# EasyEDA Pro project ADXL.epro

# Schematic USB ADXL Schematic
Board Name: Board1_1; Create Date: 2026-04-03; Page Name: P1; Project Name: Cuprite 3D Printer; Schematic Name: USB ADXL Schematic; Update Date: 2026-04-02; Company: EasyEDA.com; Page Size: A4; Version: V1.0
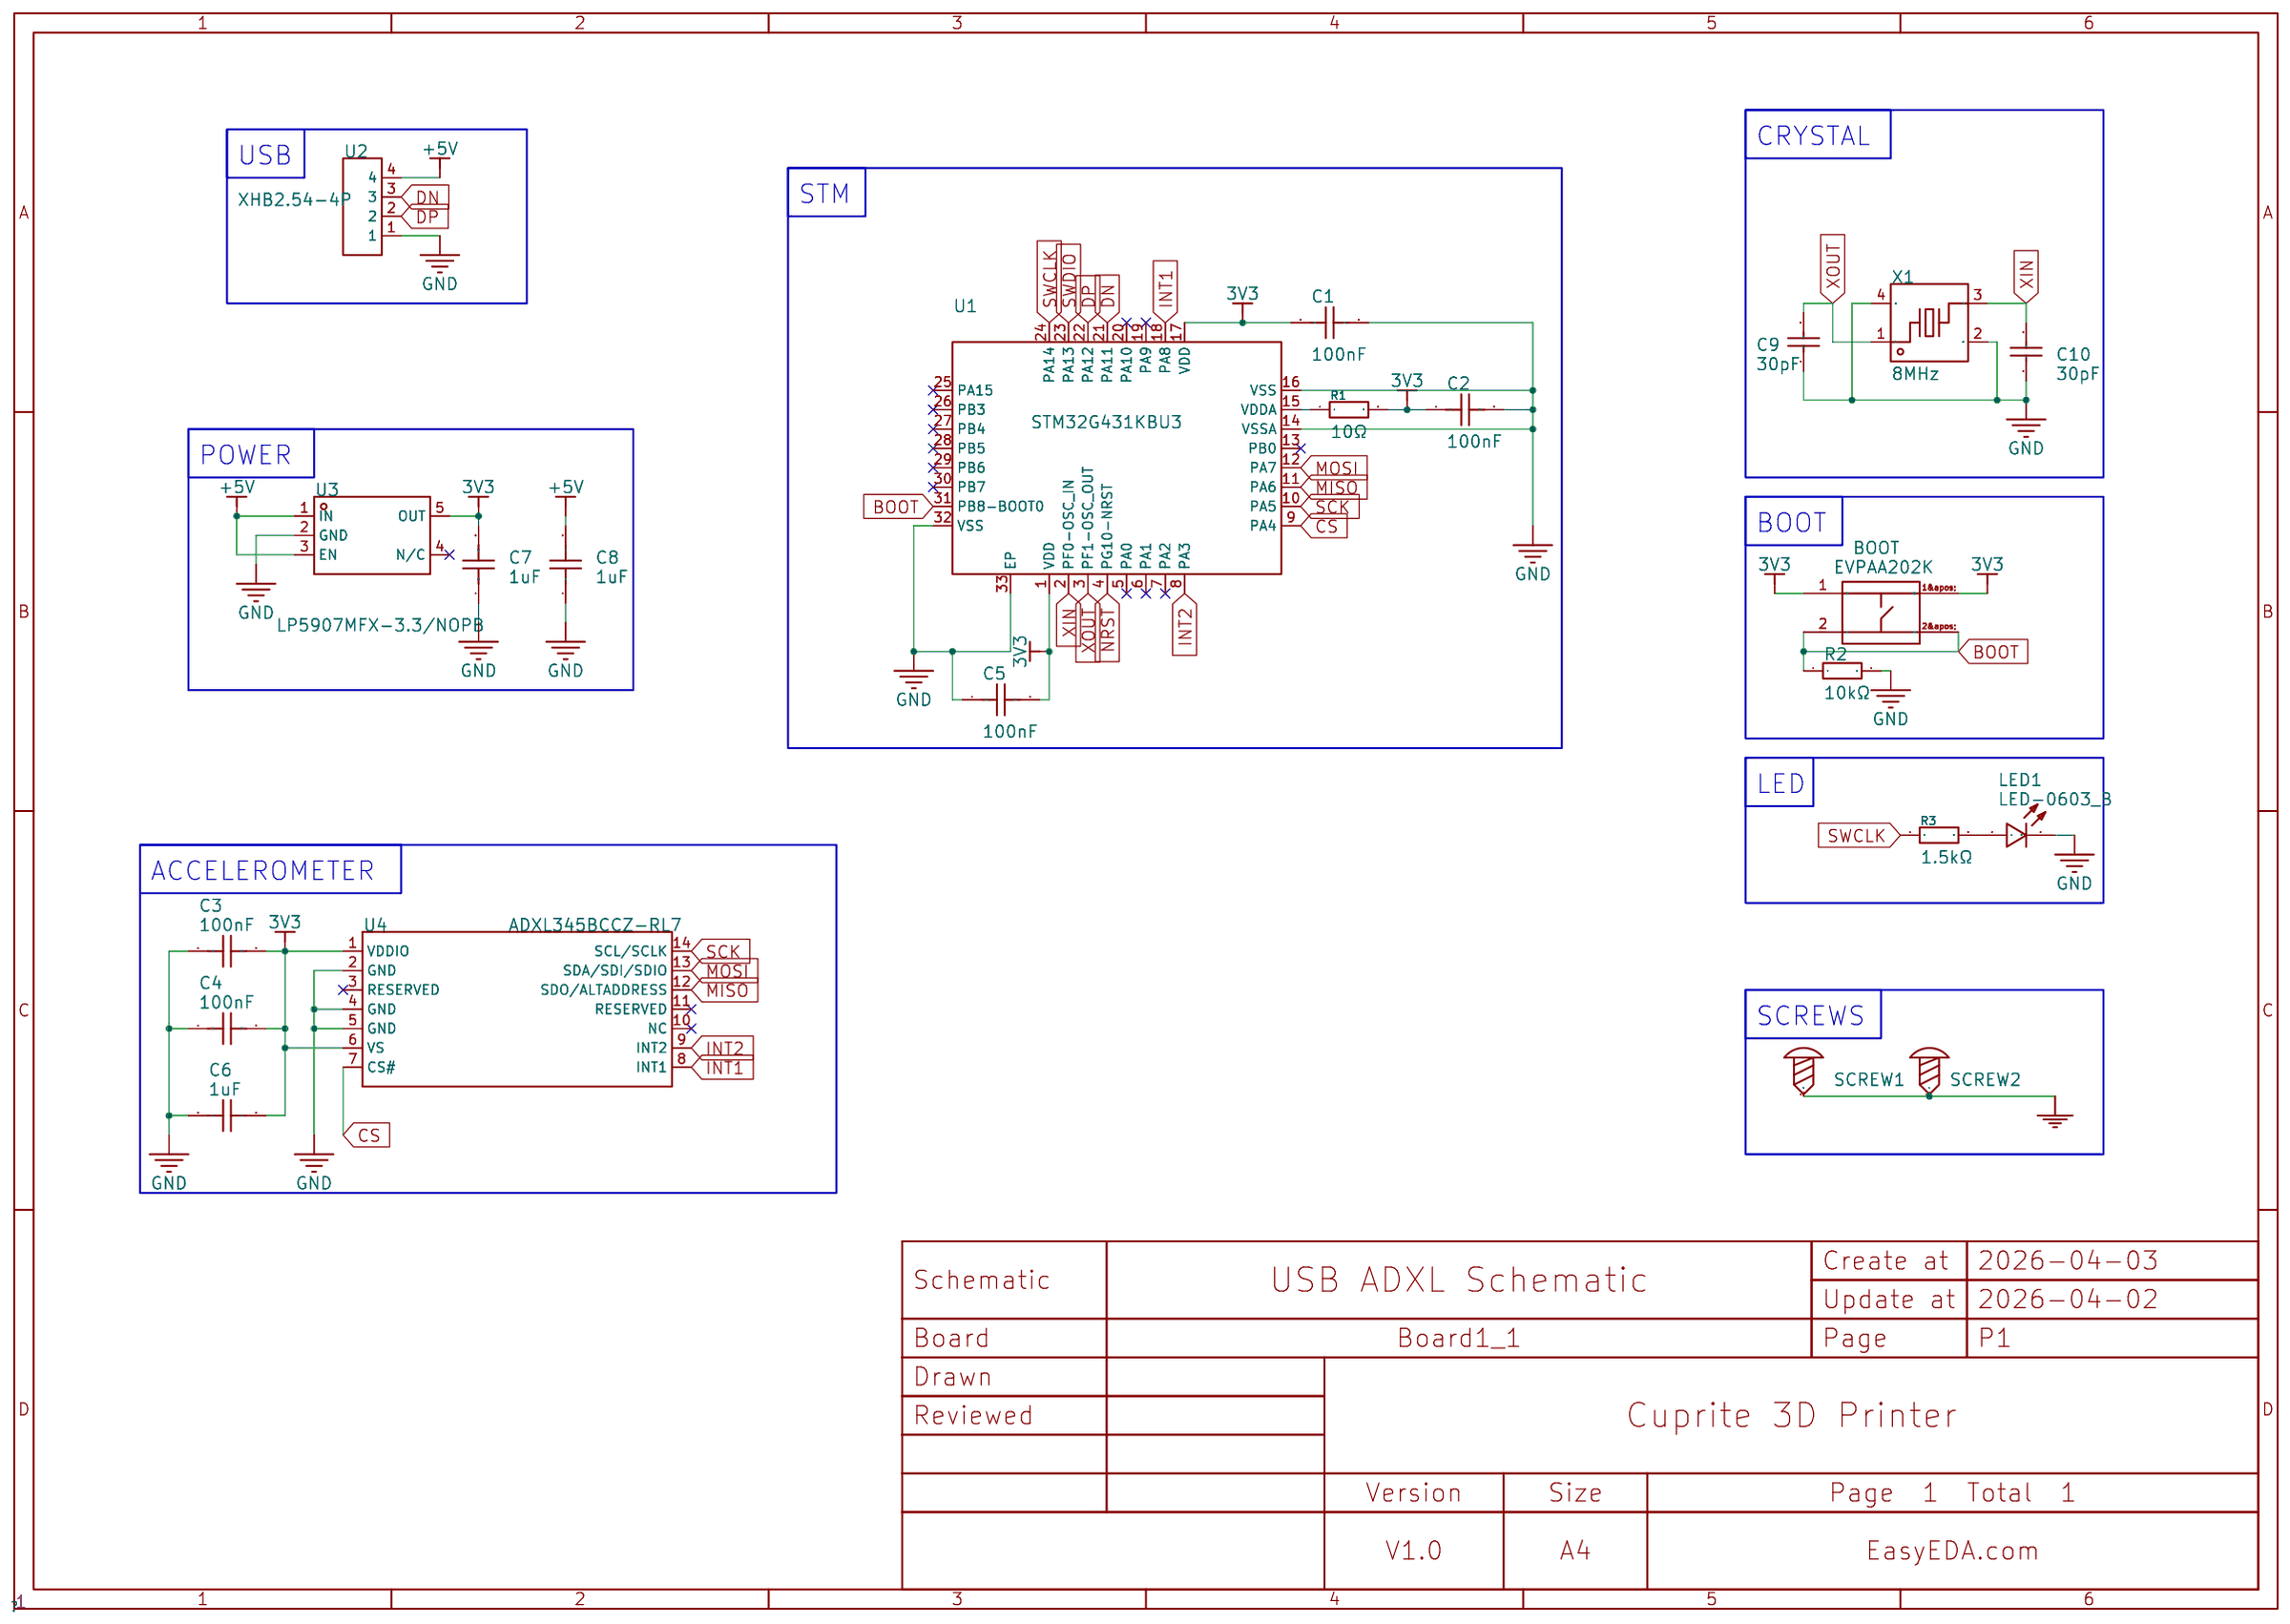
[diagram p0: schematic sheet]

## Parts
BOOT  EVPAA202K  [KEY-SMD_4P-L3.5-W2.9-P1.48-LS4.3-TL]
C1  100nF  [C0402]
C2  100nF  [C0402]
C3  100nF  [C0402]
C4  100nF  [C0402]
C5  100nF  [C0402]
C6  1uF  [C0402]
C7  1uF  [C0402]
C8  1uF  [C0402]
C9  30pF  [C0402]
C10  30pF  [C0402]
LED1  LED-0603_B  [LED0603-FD_BLUE]
R1  10Ω  [R0402]
R2  10kΩ  [R0402]
R3  1.5kΩ  [R0402]
SCREW1  -  [Screw-Hole-M3]
SCREW2  -  [Screw-Hole-M3]
U1  STM32G431KBU3  [UFQFPN-32_L5.0-W5.0-P0.50-BL-EP3.5]
U2  XHB2.54-4P  [CONN-TH_4P-P2.54-XH2.54-LI-4P]
U3  LP5907MFX-3.3/NOPB  [SOT-23-5_L3.0-W1.7-P0.95-LS2.8-BR]
U4  ADXL345BCCZ-RL7  [LGA-14_L5.0-W3.0-P0.80-BL]
X1  8MHz  [CRYSTAL-SMD_4P-L3.2-W2.5-BL-2]

## Library data of the parts
BOOT = EVPAA202K: Circuit:SPST Actuator Style:Rectangle button Operating Force:1.6N Mounting Style:Brick nogging Switch Length:3.5mm Switch Width:2.9mm Switch Height:1.7mm Contact Current:20mA Voltage Rating (AC):- Voltage Rating (DC):15V Insulation Resistance:100MΩ With L; LCSC Part Name: 3.5*2.9*1.7mm 立贴 轻触开关; Supplier Part: C79147; Manufacturer: PANASONIC(松下); Supplier Footprint: SMD,2.9x3.5mm; JLCPCB Part Class: Extended Part; Datasheet: https://atta.szlcsc.com/upload/public/pdf/source/20160718/1468827513915.pdf; Supplier: LCSC; Circuit: SPST; Actuator Style: Rectangle button; Operating Force: 1.6N; Mounting Style: Brick nogging; Switch Length: 3.5mm; Switch Width: 2.9mm; Switch Height: 1.7mm; Contact Current: 20mA; Voltage Rating (DC): 15V; Insulation Resistance: 100MΩ; Pin Style: J pin; Mechanical Life: 20万次; Operating Temperature: -40℃~+85℃
C1-C5 = CL05B104KO5NNNC: Capacitance: Tolerance:±10% Tolerance:±10% Voltage Rated: Temperature Coefficient:; LCSC Part Name: 100nF ±10% 16V; Supplier Part: C1525; Manufacturer: SAMSUNG(三星); Supplier Footprint: 0402; JLCPCB Part Class: Basic Part; Datasheet: https://atta.szlcsc.com/upload/public/pdf/source/20160218/1457707763339.pdf; Supplier: LCSC; Tolerance: ±10%
C6-C8 = CL05A105KA5NQNC: Capacitance: Tolerance:±10% Tolerance:±10% Voltage Rated: Temperature Coefficient:; LCSC Part Name: 1uF ±10% 25V; Supplier Part: C52923; Manufacturer: SAMSUNG(三星); Supplier Footprint: 0402; JLCPCB Part Class: Basic Part; Datasheet: https://atta.szlcsc.com/upload/public/pdf/source/20160218/1457707763339.pdf; Supplier: LCSC; Tolerance: ±10%
C9 C10 = 0402CG300J500NT: Capacitance:30pF Tolerance:±5% Tolerance:±5% Voltage Rating:50V Temperature Coefficient:C0G; LCSC Part Name: 30pF ±5% 50V; Supplier Part: C1570; Manufacturer: FH(风华); Supplier Footprint: 0402; JLCPCB Part Class: Extended Part; Datasheet: https://atta.szlcsc.com/upload/public/pdf/source/20200305/C486355_26A10D38EF8C2A5C37091D0039909270.pdf; Supplier: LCSC; Tolerance: ±5%; Voltage Rating: 50V; Temperature Coefficient: C0G
LED1 = 19-217/BHC-ZL1M2RY/3T: Emitted Color:Blue Power Dissipation:110mW Forward Current:5mA Dominant Wavelength:465nm~475nm Dominant Wavelength:465nm~475nm Peak Wavelength:468nm Diode Configuration:- Lens Color:Colorless Transparent Lens Color Temperature:- Color Temperature:- Viewin; LCSC Part Name: 蓝灯 停产; Supplier Part: C72041; Manufacturer: EVERLIGHT(亿光); Supplier Footprint: 0603; Datasheet: https://atta.szlcsc.com/upload/public/pdf/source/20170116/1484561237273.pdf; Supplier: LCSC; Emitted Color: Blue; Power Dissipation: 110mW; Forward Current: 5mA; Dominant Wavelength: 465nm~475nm; Peak Wavelength: 468nm; Lens Color: Colorless Transparent Lens; Viewing Angle: 120°; Operating Temperature: -40℃~+85℃
R1 = 0402WGF100JTCE: Type:Thick Film Resistors Resistance:10Ω Tolerance:±1% Tolerance:±1% Power(Watts): Overload Voltage (Max): Temperature Coefficient:±200ppm/℃ Temperature Coefficient:±200ppm/℃ Operating Temperature Range:-55℃~+155℃ Operating Temperature Range:-55℃~+155℃; LCSC Part Name: 10Ω ±1% 62.5mW 厚膜电阻; Supplier Part: C25077; Manufacturer: UNI-ROYAL(厚声); Supplier Footprint: 0402; JLCPCB Part Class: Basic Part; Datasheet: https://atta.szlcsc.com/upload/public/pdf/source/20200306/C422600_1E6D84923E4A46A82E41ADD87F860B5C.pdf; Supplier: LCSC; Type: Thick Film Resistors; Tolerance: ±1%; Temperature Coefficient: ±200ppm/℃; Operating Temperature Range: -55℃~+155℃
R2 = 0402WGF1002TCE: Type:Thick Film Resistors Resistance:10kΩ Tolerance:±1% Tolerance:±1% Power(Watts): Overload Voltage (Max): Temperature Coefficient:±100ppm/℃ Temperature Coefficient:±100ppm/℃ Operating Temperature Range:-55℃~+155℃ Operating Temperature Range:-55℃~+155℃; LCSC Part Name: 10kΩ ±1% 62.5mW 厚膜电阻; Supplier Part: C25744; Manufacturer: UNI-ROYAL(厚声); Supplier Footprint: 0402; JLCPCB Part Class: Basic Part; Datasheet: https://atta.szlcsc.com/upload/public/pdf/source/20200306/C422600_1E6D84923E4A46A82E41ADD87F860B5C.pdf; Supplier: LCSC; Type: Thick Film Resistors; Tolerance: ±1%; Temperature Coefficient: ±100ppm/℃; Operating Temperature Range: -55℃~+155℃
R3 = 0402WGF1501TCE: Type:Thick Film Resistors Resistance:1.5kΩ Tolerance:±1% Tolerance:±1% Power(Watts): Overload Voltage (Max): Temperature Coefficient:±100ppm/℃ Temperature Coefficient:±100ppm/℃ Operating Temperature Range:-55℃~+155℃ Operating Temperature Range:-55℃~+155℃; LCSC Part Name: 1.5kΩ ±1% 62.5mW 厚膜电阻; Supplier Part: C25867; Manufacturer: UNI-ROYAL(厚声); Supplier Footprint: 0402; JLCPCB Part Class: Basic Part; Datasheet: https://atta.szlcsc.com/upload/public/pdf/source/20200306/C422600_1E6D84923E4A46A82E41ADD87F860B5C.pdf; Supplier: LCSC; Type: Thick Film Resistors; Tolerance: ±1%; Temperature Coefficient: ±100ppm/℃; Operating Temperature Range: -55℃~+155℃
SCREW1 SCREW2 = Screw-Hole-M3: Supplier Footprint: 插件
U1 = STM32G431KBU3: CPU Core:ARM-M4 CPU Maximum Speed:170MHz Program Storage Size:128KB Program Memory Type:FLASH Number of I/O:26 ADC (Bit):12bit DAC (Bit):12bit Voltage - Supply:1.71V~3.6V Voltage - Supply:1.71V~3.6V Applications:-; LCSC Part Name: 带DSP和FPU的170MHz主流ARM Cortex-M4 MCU，具有128 KB Flash存储器、数学加速器和中等模拟电平集成; Supplier Part: C1341901; Manufacturer: ST(意法半导体); Supplier Footprint: UFQFPN-32(5x5); JLCPCB Part Class: Extended Part; Datasheet: https://atta.szlcsc.com/upload/public/pdf/source/20210607/F3CD0646E5D00AAFDE875C196C2D7333.pdf; Supplier: LCSC; CPU Core: ARM-M4; CPU Maximum Speed: 170MHz; Program Storage Size: 128KB; Program Memory Type: FLASH; Number of I/O: 26; ADC (Bit): 12bit; DAC (Bit): 12bit; Voltage - Supply: 1.71V~3.6V
U2 = XHB2.54-4P: Supplier Part: C9900014704; JLCPCB Part Class: Extended Part; Supplier: LCSC
U3 = LP5907MFX-3.3/NOPB: Output Type:Fixed Maximum Input Voltage:5.5V Output Voltage:3.3V Output Voltage:3.3V Output Current:250mA Power Supply Rejection Ratio (PSRR):90dB@(100Hz)；60dB@(100kHz) Dropout Voltage:250mV@(250mA) standby current:25uA Feature:ESD Protection；Short-Circui; LCSC Part Name: 具有低 IQ 和使能功能的 250mA、低噪声、高 PSRR、超低压降稳压器; Supplier Part: C80670; Manufacturer: TI(德州仪器); Supplier Footprint: SOT-23-5; JLCPCB Part Class: Extended Part; Datasheet: https://www.ti.com/cn/lit/gpn/lp5907; Supplier: LCSC; Output Type: Fixed; Maximum Input Voltage: 5.5V; Output Voltage: 3.3V; Output Current: 250mA; Power Supply Rejection Ratio (PSRR): 90dB@(100Hz)；60dB@(100kHz); Dropout Voltage: 250mV@(250mA); standby current: 25uA; Feature: ESD Protection；Short-Circuit  Protection；Automatic Discharge Function；Low ESR；Thermal Protection(TSD)；Under-voltage Lockout；With ability; Operating Temperature: -40℃~+125℃; Output Polarity: Positive electrode; Number of Outputs: 1
U4 = ADXL345BCCZ-RL7: LCSC Part Name: 3轴、±2 G/±4 G/±8 G/±16 G数字加速度计; Supplier Part: C9667; Manufacturer: ADI(亚德诺); Supplier Footprint: LGA-14(3x5); Datasheet: https://atta.szlcsc.com/upload/public/pdf/source/20170717/C9667_1500286943358822273.pdf; Supplier: LCSC
X1 = 3TJ480000ZYLBC: Crystal Type:贴片晶振 Frequency: Normal temperature Frequency Tolerance:±10ppm Normal temperature Frequency Tolerance:±10ppm External load capacitor: Frequency Stability(Full temperature range):±30ppm Frequency Stability(Full temperature range):±30ppm Equival; LCSC Part Name: 8MHz ±10ppm 20pF; Supplier Part: C2924619; Manufacturer: JYJE(晶友嘉); Supplier Footprint: SMD3225-4P; JLCPCB Part Class: Extended Part; Datasheet: https://atta.szlcsc.com/upload/public/pdf/source/20211130/B5ADCBD4910B6AF213F8ADEED5AB255F.pdf; Supplier: LCSC; Crystal Type: 贴片晶振; Normal temperature Frequency Tolerance: ±10ppm; Frequency Stability(Full temperature range): ±30ppm; Equivalent Series Resistance (ESR): 150Ω

## Nets
3V3: BOOT.1 BOOT.1&apos; C1.1 C2.1 C3.2 C4.2 C5.2 C6.2 C7.2 R1.2 U1.1(VDD) U1.17(VDD) U3.5(OUT) U4.1(VDDIO) U4.6(VS)
+5V: C8.2 U2.4 U3.1(IN) U3.3(EN)
GND: C1.2 C2.2 C3.1 C4.1 C5.1 C6.1 C7.1 C8.1 C9.1 C10.1 LED1.1(C) R2.2 SCREW1.1 SCREW2.1 U1.14(VSSA) U1.16(VSS) U1.32(VSS) U1.33(EP) U2.1 U3.2(GND) U4.2(GND) U4.4(GND) U4.5(GND) X1.2(GND) X1.4(GND)
BOOT: BOOT.2 BOOT.2&apos; R2.1 U1.31(PB8-BOOT0)
CS: U1.9(PA4) U4.7(CS#)
DN: U1.21(PA11) U2.3
DP: U1.22(PA12) U2.2
INT1: U1.18(PA8) U4.8(INT1)
INT2: U1.8(PA3) U4.9(INT2)
MISO: U1.11(PA6) U4.12(SDO/ALTADDRESS)
MOSI: U1.12(PA7) U4.13(SDA/SDI/SDIO)
NRST: U1.4(PG10-NRST)
SCK: U1.10(PA5) U4.14(SCL/SCLK)
SWCLK: R3.1 U1.24(PA14)
SWDIO: U1.23(PA13)
XIN: C10.2 U1.2(PF0-OSC_IN) X1.3
XOUT: C9.2 U1.3(PF1-OSC_OUT) X1.1
$1N3100: R1.1 U1.15(VDDA)
$1N5035: LED1.2(A) R3.2

Not connected (* = marked no-connect by the designer): U1 5(PA0)* 6(PA1)* 7(PA2)* 13(PB0)* 19(PA9)* 20(PA10)* 25(PA15)* 26(PB3)* 27(PB4)* 28(PB5)* 29(PB6)* 30(PB7)*; U3 4(N/C)*; U4 3(RESERVED)* 10(NC)* 11(RESERVED)*

## Notes on the sheet
- CRYSTAL
- USB
- STM
- POWER
- BOOT
- LED
- ACCELEROMETER
- SCREWS

# Board PCB1_1
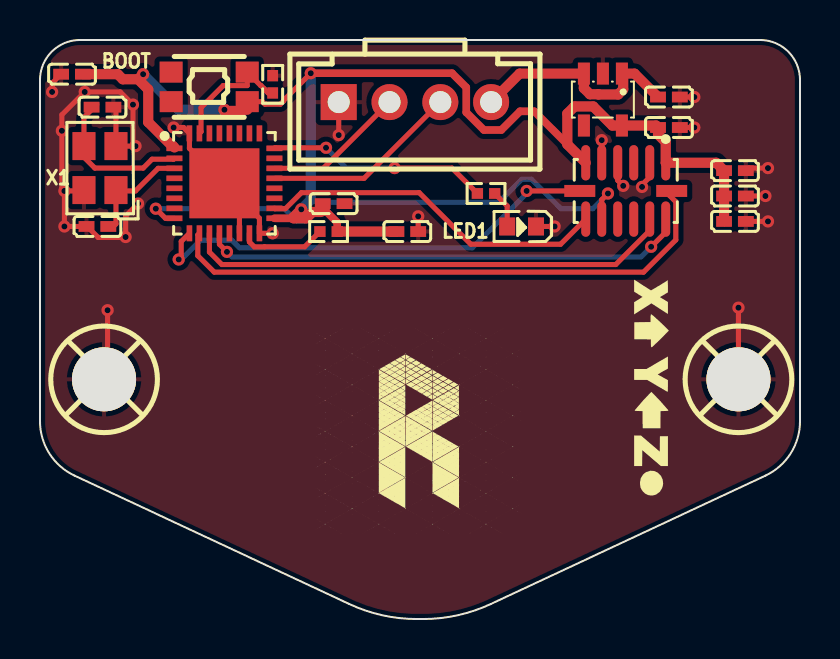
[diagram p1: board, top side]
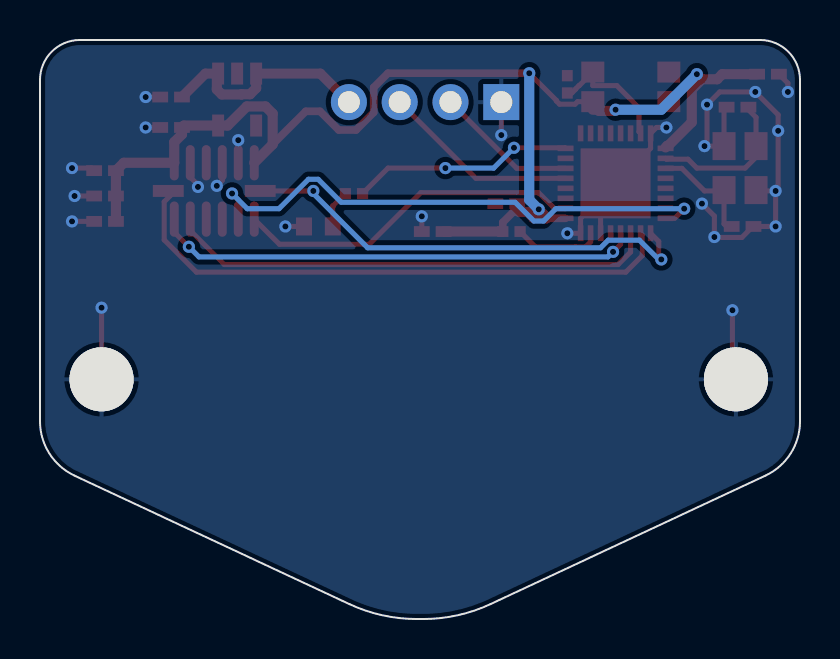
[diagram p2: board, bottom side, seen from below]

Outline 38 x 28.98 mm; copper layers: Top Layer, Bottom Layer. Coordinates in mm from the lower left corner of the outline.
Outline path: 0,26.98 0,9.89 arc(0.47,8.28) 1.73,7.18 15.46,0.75 arc(17.11,0.19) 18.85,0 19.15,0 arc(20.89,0.19) 22.54,0.75 36.27,7.18 arc(37.53,8.28) 38,9.89 38,26.98 arc(37.41,28.39) 36,28.98 2,28.98 arc(0.59,28.39) 0,26.98
Stack: Top Layer 0.035mm / Dielectric1 1.51mm FR4 er 4.5 / Bottom Layer 0.035mm

## Design rules (mm)
spacing copperThickness1oz (default): track to track 0.102, other pairs 0.152 to 0.3
spacing copperThickness2oz: track to track 0.203, other pairs 0.152 to 0.3
spacing Plane_innerPlane: track to track 0.102, other pairs 0.152 to 0.3
spacing Copper_copperRegion: track to track 0.102, other pairs 0.152 to 0.3
track width copperThickness1oz (default): min 0.127, default 0.254, max 2.54
track width copperThickness2oz: min 0.203, default 0.254, max 2.54
differential pair differentialPair (default): width min 0.127, default 0.254, max 2.54; gap min 0.152, default 0.152
pour e255 uses Copper_copperRegion
pour e268 uses Copper_copperRegion

## Placement (name value [footprint] x y rotation side)
BOOT  EVPAA202K  [KEY-SMD_4P-L3.5-W2.9-P1.48-LS4.3-TL]  8.46 26.63 180 top
C1  100nF  [C0402]  14.68 20.79 0 top
C2  100nF  [C0402]  18.36 19.39 0 top
C3  100nF  [C0402]  34.75 22.44 180 top
C4  100nF  [C0402]  34.75 21.17 180 top
C5  100nF  [C0402]  1.6 27.26 0 top
C6  1uF  [C0402]  34.75 19.9 180 top
C7  1uF  [C0402]  31.45 24.6 180 top
C8  1uF  [C0402]  31.45 26.12 180 top
C9  30pF  [C0402]  2.87 19.64 0 top
C10  30pF  [C0402]  3.12 25.61 180 top
LED1  LED-0603_B  [LED0603-FD_BLUE]  24.08 19.64 180 top
R1  10Ω  [R0402]  14.43 19.39 0 top
R2  10kΩ  [R0402]  11.63 26.76 90 top
R3  1.5kΩ  [R0402]  22.3 21.29 0 top
SCREW1  -  [Screw-Hole-M3]  34.86 12.06 180 top
SCREW2  -  [Screw-Hole-M3]  3.14 12.06 180 top
U1  STM32G431KBU3  [UFQFPN-32_L5.0-W5.0-P0.50-BL-EP3.5]  9.22 21.8 270 top
U2  XHB2.54-4P  [CONN-TH_4P-P2.54-XH2.54-LI-4P]  18.75 25.87 0 top
U3  LP5907MFX-3.3/NOPB  [SOT-23-5_L3.0-W1.7-P0.95-LS2.8-BR]  28.14 25.99 90 top
U4  ADXL345BCCZ-RL7  [LGA-14_L5.0-W3.0-P0.80-BL]  29.29 21.42 180 top
X1  8MHz  [CRYSTAL-SMD_4P-L3.2-W2.5-BL-2]  3 22.56 90 top

## Footprints (pads in the part's own frame, mm; a bottom-side part is the same pattern mirrored in y, then rotated)
C0402
  rect 0.79x0.54 smd: 1(-0.545,0) 2(0.545,0)
CONN-TH_4P-P2.54-XH2.54-LI-4P
  rect 1.8x1.8 hole 1.1: 1(-3.81,0)
  round 1.8 hole 1.1: 2(-1.27,0) 3(1.27,0) 4(3.81,0)
CRYSTAL-SMD_4P-L3.2-W2.5-BL-2
  rect 1.4x1.15 smd: 1(-1.1,-0.8) 2(1.1,-0.8) 3(1.1,0.8) 4(-1.1,0.8)
KEY-SMD_4P-L3.5-W2.9-P1.48-LS4.3-TL
  rect 1.15x1.05 smd: 1(-1.902,0.74) 1'(1.899,0.74) 2(-1.902,-0.74) 2'(1.902,-0.74)
LED0603-FD_BLUE
  rect 0.8x0.9 smd: 1(-0.72,0) 2(0.72,0)
LGA-14_L5.0-W3.0-P0.80-BL
  oval 0.448x1.769 smd: 1(-2,-1.409) 2(-1.2,-1.409) 3(-0.4,-1.409) 4(0.4,-1.409) 5(1.2,-1.409) 6(2,-1.409) 8(2,1.409) 9(1.2,1.409) 10(0.4,1.409) 11(-0.4,1.409) 12(-1.2,1.409) 13(-2,1.409)
  rect 1.545x0.6 smd: 7(2.297,0) 14(-2.297,0)
R0402
  rect 0.566x0.54 smd: 1(-0.433,0) 2(0.433,0)
Screw-Hole-M3
  round 3.2 hole 3.2: 1(-0.064,0.064)
SOT-23-5_L3.0-W1.7-P0.95-LS2.8-BR
  rect 1.1x0.6 smd: 1(1.3,-0.95) 2(1.3,0) 3(1.3,0.95) 4(-1.3,0.95) 5(-1.3,-0.95)
UFQFPN-32_L5.0-W5.0-P0.50-BL-EP3.5
  rect 0.28x0.8 smd: 1(-1.75,-2.5) 2(-1.25,-2.5) 3(-0.75,-2.5) 4(-0.25,-2.5) 5(0.25,-2.5) 6(0.75,-2.5) 7(1.25,-2.5) 8(1.75,-2.5) 17(1.75,2.5) 18(1.25,2.5) 19(0.75,2.5) 20(0.25,2.5) 21(-0.25,2.5) 22(-0.75,2.5) 23(-1.25,2.5) 24(-1.75,2.5)
  rect 0.8x0.28 smd: 9(2.5,-1.75) 10(2.5,-1.25) 11(2.5,-0.75) 12(2.5,-0.25) 13(2.5,0.25) 14(2.5,0.75) 15(2.5,1.25) 16(2.5,1.75) 25(-2.5,1.75) 26(-2.5,1.25) 27(-2.5,0.75) 28(-2.5,0.25) 29(-2.5,-0.25) 30(-2.5,-0.75) 31(-2.5,-1.25) 32(-2.5,-1.75)
  rect 3.5x3.5 smd: 33(0,0)

## Nets
As in the schematic, except:
3V3: BOOT.1 C1.1 C2.1 C3.2 C4.2 C5.2 C6.2 C7.2 R1.2 U1.1 U1.17 U3.5 U4.1 U4.6
BOOT: BOOT.2 R2.1 U1.31

Pads without a net: BOOT 1' 2'; U1 5 6 7 13 19 20 25 26 27 28 29 30; U3 4; U4 3 10 11

## Via types
v1: diameter 0.61, hole 0.305, Top Layer to Bottom Layer, 36 vias

## Routing (per net, layer and track width the routed paths; a pad name or vN(x,y) marks a point on that pad's centre or on a via; arc(x,y) is an arc through that point)
3V3: length 63.6
  Top Layer w0.254: BOOT.1 11.12,25.89 11.25,25.76 12.02,25.76 12.18,25.92 12.18,25.95 v1(13.54,27.31) ; 10.36,25.48 10.36,25.65 10.48,25.77
  Top Layer w0.381: R1.2 14.86,19.84 14.34,20.37 14.05,20.37 ; v1(13.54,27.31) 20.6,27.31 21.31,26.6 21.31,25.35 22.2,24.47 23.06,24.47 24,25.41 24.71,25.41 26.37,23.75 ; U1.17 12.68,20.05
  Top Layer w0.508: v1(13.06,20.5) 12.65,20.08 12.68,20.05 13.31,20.05 13.63,20.37 14.05,20.37 ; 4.9,27.01 4.14,27.01 3.89,27.26 C5.2 ; 4.9,27.01 5.41,26.5 5.41,24.86 6.59,23.68 6.64,23.68 6.72,23.6 ; 4.9,27.01 v1(5.16,27.26) ; R1.2 C2.1 ; C6.2 C4.2 C3.2 33.81,22.83 U4.1 31.29,23.87 30.9,24.25 C7.2 30.8,24.69 U3.5 28.62,24.69 27.66,25.65 26.73,25.65 26.37,25.29 26.37,23.75 U4.6 ; v1(9.22,25.48) 9.28,25.42 10.05,25.42 10.11,25.48 10.36,25.48 ; BOOT.1 10.48,25.77
  Bottom Layer w0.508: v1(13.06,20.5) 13.54,20.98 v1(13.54,27.31) ; v1(5.16,27.26) 6.94,25.48 v1(9.22,25.48)
+5V: length 11.3
  Top Layer w0.5: C8.2 29.73,27.29 U3.1 ; U2.4 23.98,27.29 U3.3
  Top Layer w0.508: U3.1 29.09,27.17 29.16,27.1 29.16,26.5 28.91,26.25 27.93,26.25 27.91,26.26 27.5,26.26 27.19,26.56 U3.3
GND: length 51.1
  Top Layer w0.254: C2.2 v1(18.91,20.15) ; v1(6.68,24.6) 7.18,24.6 U1.32 7.47,23.55 U1.33 9.97,21.05 ; C8.1 v1(32.72,26.12) ; 9.97,21.05 U1.14 ; 9.97,21.05 10.97,20.05 U1.16 v1(11.63,19.3) ; v1(4.9,20.79) 4.28,20.16 v1(4.28,19.11) 4.26,19.09 2.91,19.09 2.36,19.64 v1(1.22,19.64) v1(1.22,21.42) ; C5.1 0.6,26.81 v1(0.6,26.37) ; C7.1 v1(32.72,24.6) ; 30.05,21.68 30.49,22.11 U4.2 ; SCREW2.1 3.38,12.17 v1(3.38,15.45) ; X1.4 2.16,21.42 v1(1.22,21.42) ; LED1.1 v1(25.73,19.64) ; v1(29.16,21.68) 28.89,21.95 U4.4 ; v1(1.22,21.42) 1.09,21.55 v1(1.09,24.43) 1.09,25.23 v1(2.24,26.37) 4.01,26.37 v1(4.65,25.74) 4.65,23.79 v1(4.78,23.66) X1.2 3.8,25.61 3.92,25.74 ; v1(36.4,22.56) 35.42,22.56 C3.1 ; C4.1 v1(36.27,21.17) ; U2.1 v1(14.94,24.22) ; SCREW1.1 v1(34.92,15.58) ; U4.5 v1(28.09,23.96) ; C6.1 v1(36.4,19.9)
  vias: v1(30.1,21.62)
BOOT: length 6.5
  Top Layer w0.254: R2.1 11.41,26.32 11.22,26.51 11.22,26.53 11.05,26.69 11.04,26.69 BOOT.2 10.36,26.69 9.16,26.69 8.05,25.59 8.05,24.38 U1.31
CS: length 23.4
  Top Layer w0.254: U1.9 7.06,18.89 7.06,18.12 v1(6.94,17.99) ; v1(24.33,21.42) U4.7
  Bottom Layer w0.254: v1(24.33,21.42) 24.33,21.29 21.62,18.58 9.97,18.58 9.59,18.96 8.03,18.96 7.06,17.99 v1(6.94,17.99)
DN: length 9.9
  Top Layer w0.254: U2.3 16.2,22.05 U1.21
DP: length 7.1
  Top Layer w0.254: U1.22 14.16,22.55 17.48,25.87
INT1: length 17.5
  Top Layer w0.254: U1.18 11.74,20.53 12.27,20.53 13.07,21.34 18.96,21.34 21.54,18.75 26.03,18.75 U4.8
INT2: length 27.2
  Top Layer w0.254: U4.9 28.09,20.98 v1(28.4,21.29) ; U1.8 6.27,20.05 v1(5.79,20.53)
  Bottom Layer w0.254: v1(28.4,21.29) 27.64,20.53 26.05,20.53 24.58,22.01 24.09,22.01 22.94,20.85 14.24,20.85 13.3,19.92 12.82,19.92 12.2,20.53 v1(5.79,20.53)
MISO: length 24.5
  Top Layer w0.254: U1.11 8.47,18.36 9.09,17.74 28.79,17.74 30.49,19.44 U4.12
MOSI: length 24.3
  Top Layer w0.254: v1(9.35,18.37) 8.97,18.75 U1.12 ; v1(30.56,18.63) 31.29,19.36 U4.13
  Bottom Layer w0.254: v1(9.35,18.37) 9.6,18.12 30.05,18.12 v1(30.56,18.63)
SCK: length 28.7
  Top Layer w0.254: U4.14 31.5,21.33 31.5,21.18 31.79,20.88 31.79,18.97 30.18,17.36 8.71,17.36 7.89,18.18 7.89,19.22 U1.10
SWCLK: length 11.1
  Top Layer w0.254: v1(17.73,22.56) 20.6,22.56 R3.1 ; v1(14.3,23.58) 11.75,23.58 U1.24
  Bottom Layer w0.254: v1(17.73,22.56) 15.32,22.56 v1(14.3,23.58)
XIN: length 7.8
  Top Layer w0.254: U1.2 6.68,23.01 5.6,23.01 5.16,22.56 2.74,22.56 2.2,23.11 X1.3 2.2,25.1 2.83,25.74
XOUT: length 5.5
  Top Layer w0.254: U1.3 5.91,22.55 4.78,21.42 3.84,21.42 X1.1 3.8,19.77 3.67,19.64 3.42,19.64
$1N3100: length 4.4
  Top Layer w0.254: R1.1 13.23,18.63 11.23,18.63 11.23,18.62 10.72,18.62 10.47,18.87 U1.15
$1N5035: length 1.9
  Top Layer w0.254: R3.2 23.36,20.67 LED1.2

## Copper pours and planes (outline as drawn; the poured copper is in the pictures)
GND on Top Layer: -4.75,33.49 45.8,33.49 45.8,-4.23 -4.75,-4.23
GND on Bottom Layer: -7.04,31.84 45.03,31.84 45.03,-4.11 -7.04,-4.11
